# Altium schematic sheet DAP_Scheme.SchDoc
size 420 x 297 mm; Author: ALTIUM GOSTBOM2.0 KEV; SheetNumber: 2; SheetTotal: 3
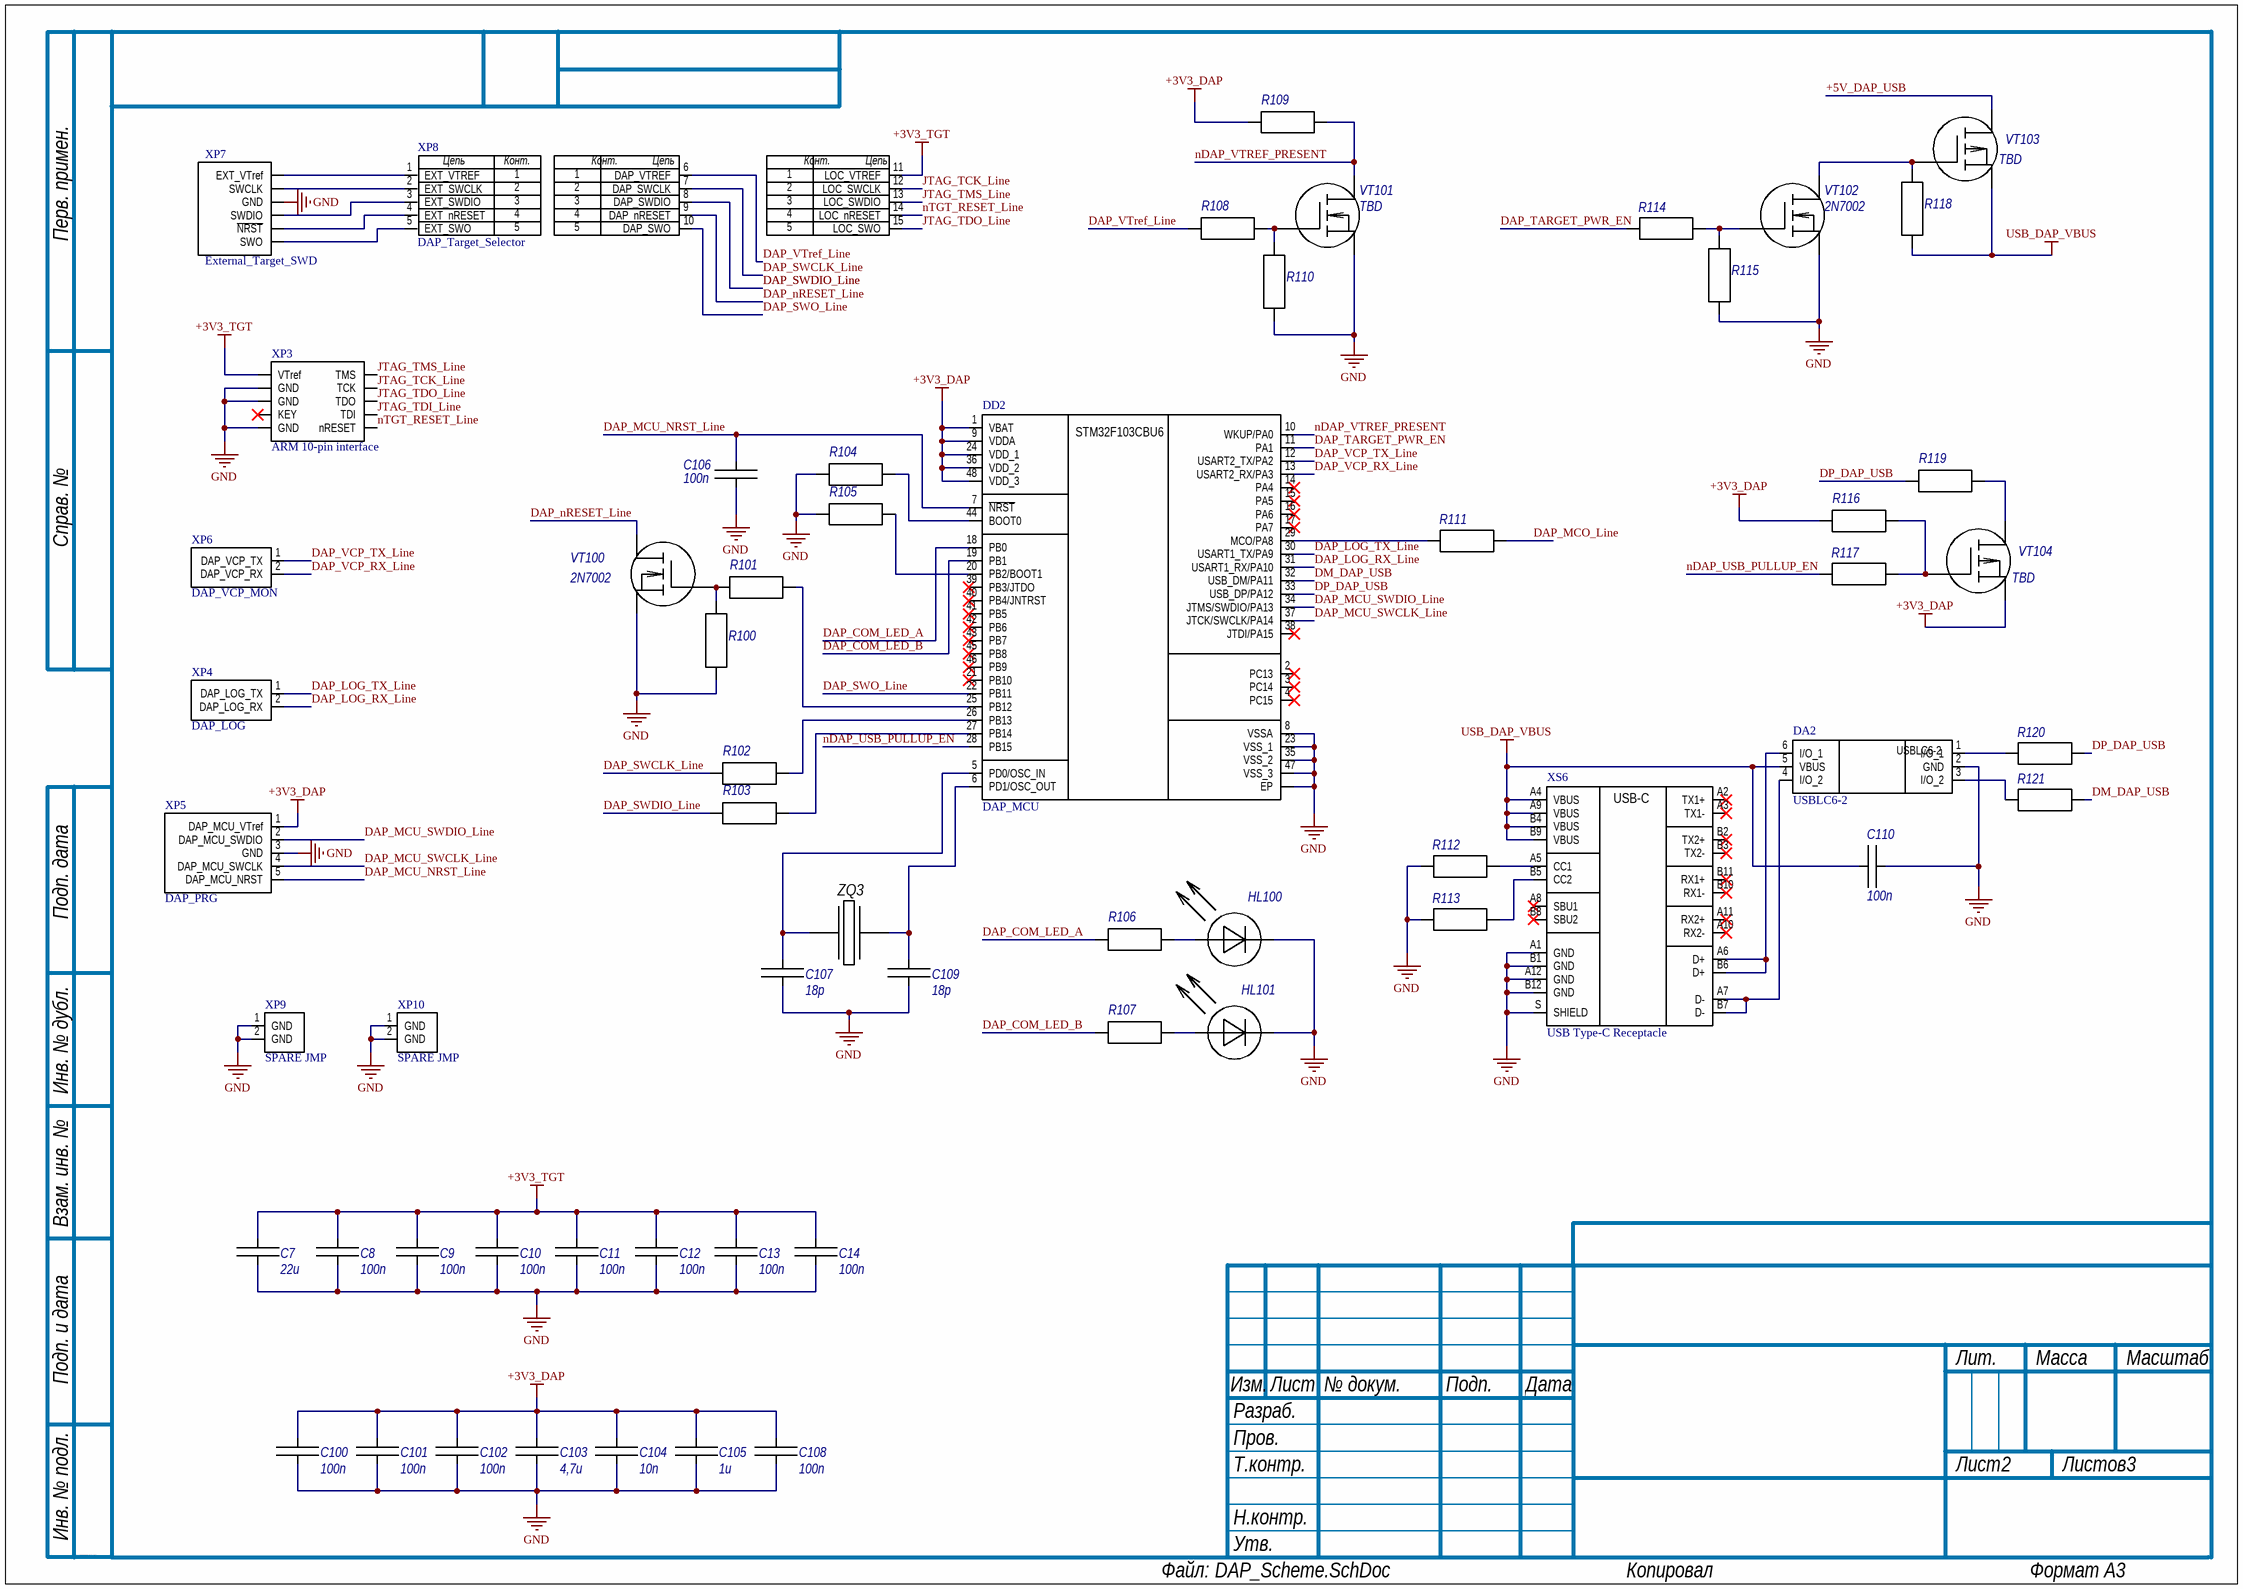
[diagram p0: DAP_Scheme.SchDoc]

## Parts
C7  22u
C8  100n
C9  100n
C10  100n
C11  100n
C12  100n
C13  100n
C14  100n
C100  100n
C101  100n
C102  100n
C103  4,7u
C104  10n
C105  1u
C106  100n
C107  18p
C108  100n
C109  18p
C110  100n
DA2  USBLC6-2
DD2  DAP_MCU
HL100  TBD  (value not drawn)
HL101  TBD  (value not drawn)
R100  10k  (value not drawn)
R101  1k  (value not drawn)
R102  TBD  (value not drawn)
R103  TBD  (value not drawn)
R104  10k  (value not drawn)
R105  10k  (value not drawn)
R106  5,1k  (value not drawn)
R107  5,1k  (value not drawn)
R108  1k  (value not drawn)
R109  10k  (value not drawn)
R110  10k  (value not drawn)
R111  22  (value not drawn)
R112  5,1k  (value not drawn)
R113  5,1k  (value not drawn)
R114  1k  (value not drawn)
R115  10k  (value not drawn)
R116  10k  (value not drawn)
R117  1k  (value not drawn)
R118  10k  (value not drawn)
R119  1,5k  (value not drawn)
R120  22  (value not drawn)
R121  22  (value not drawn)
VT100  2N7002
VT101  TBD
VT102  2N7002
VT103  TBD
VT104  TBD
XP3  ARM 10-pin interface  [ARM 10-pin interface]
XP4  DAP_LOG  [DAP_LOG]
XP5  DAP_PRG  [DAP_PRG]
XP6  DAP_VCP_MON  [DAP_VCP_MON]
XP7  External_Target_SWD  [External_Target_SWD]
XP8  DAP_Target_Selector
XP9  SPARE JMP  [SPARE JMP]
XP10  SPARE JMP  [SPARE JMP]
XS6  USB Type-C Receptacle  [TE USB-C 2129691-1]
ZQ3  Кварцевые резонаторы  [DSO-N4]  (value not drawn)

## Nets
+3V3_DAP: C100.1 C101.1 C102.1 C103.1 C104.1 C105.1 C108.1 DD2.1(VBAT) DD2.9(VDDA) DD2.24(VDD_1) DD2.36(VDD_2) DD2.48(VDD_3) R109.1 R116.1 VT104.S XP5.1(DAP_MCU_VTref)
+3V3_TGT: C7.1 C8.1 C9.1 C10.1 C11.1 C12.1 C13.1 C14.1 XP3.1(VTref) XP8.11(LOC_VTREF)
GND: C7.2 C8.2 C9.2 C10.2 C11.2 C12.2 C13.2 C14.2 C100.2 C101.2 C102.2 C103.2 C104.2 C105.2 C106.2 C107.2 C108.2 C109.2 C110.2 DA2.2(GND) DD2.8(VSSA) DD2.23(VSS_1) DD2.35(VSS_2) DD2.47(VSS_3) DD2.49(EP) HL100.2(C) HL101.2(C) R100.2 R104.2 R105.2 R110.2 R112.2 R113.2 R115.2 VT100.S VT101.S VT102.S XP3.3(GND) XP3.5(GND) XP3.9(GND) XP5.3(GND) XP7.3(GND) XP9.1(GND) XP9.2(GND) XP10.1(GND) XP10.2(GND) XS6.A1(GND) XS6.A12(GND) XS6.B1(GND) XS6.B12(GND) XS6.S(SHIELD)
USB_DAP_VBUS: C110.1 DA2.5(VBUS) R118.2 VT103.S XS6.A4(VBUS) XS6.A9(VBUS) XS6.B4(VBUS) XS6.B9(VBUS)
+5V_DAP_USB: VT103.D
DAP_COM_LED_A: DD2.18(PB0) R106.1
DAP_COM_LED_B: DD2.19(PB1) R107.1
DAP_LOG_RX_Line: DD2.31(USART1_RX/PA10) XP4.2(DAP_LOG_RX)
DAP_LOG_TX_Line: DD2.30(USART1_TX/PA9) XP4.1(DAP_LOG_TX)
DAP_MCO_Line: R111.1
DAP_MCU_NRST_Line: C106.1 DD2.7(~{NRST}) XP5.5(DAP_MCU_NRST)
DAP_MCU_SWCLK_Line: DD2.37(JTCK/SWCLK/PA14) XP5.4(DAP_MCU_SWCLK)
DAP_MCU_SWDIO_Line: DD2.34(JTMS/SWDIO/PA13) XP5.2(DAP_MCU_SWDIO)
DAP_nRESET_Line: VT100.D XP8.9(DAP_nRESET)
DAP_SWCLK_Line: R102.2 XP8.7(DAP_SWCLK)
DAP_SWDIO_Line: R103.2 XP8.8(DAP_SWDIO)
DAP_SWO_Line: DD2.22(PB11) XP8.10(DAP_SWO)
DAP_TARGET_PWR_EN: DD2.11(PA1) R114.2
DAP_VCP_RX_Line: DD2.13(USART2_RX/PA3) XP6.2(DAP_VCP_RX)
DAP_VCP_TX_Line: DD2.12(USART2_TX/PA2) XP6.1(DAP_VCP_TX)
DAP_VTref_Line: R108.1 XP8.6(DAP_VTREF)
DM_DAP_USB: DD2.32(USB_DM/PA11) R121.1
DP_DAP_USB: DD2.33(USB_DP/PA12) R119.1 R120.1
JTAG_TCK_Line: XP3.4(TCK) XP8.12(LOC_SWCLK)
JTAG_TDI_Line: XP3.8(TDI)
JTAG_TDO_Line: XP3.6(TDO) XP8.15(LOC_SWO)
JTAG_TMS_Line: XP3.2(TMS) XP8.13(LOC_SWDIO)
nDAP_USB_PULLUP_EN: DD2.28(PB15) R117.2
nDAP_VTREF_PRESENT: DD2.10(WKUP/PA0) R109.2 VT101.D
nTGT_RESET_Line: XP3.10(nRESET) XP8.14(LOC_nRESET)
NetC107_1: C107.1 DD2.5(PD0/OSC_IN) ZQ3.1
NetC109_1: C109.1 DD2.6(PD1/OSC_OUT) ZQ3.3
NetDA2_1: DA2.1(I/O_1) R120.2
NetDA2_3: DA2.3(I/O_2) R121.2
NetDA2_4: DA2.4(I/O_2) XS6.A7(D-) XS6.B7(D-)
NetDA2_6: DA2.6(I/O_1) XS6.A6(D+) XS6.B6(D+)
NetDD2_20: DD2.20(PB2/BOOT1) R105.1
NetDD2_25: DD2.25(PB12) R101.1
NetDD2_26: DD2.26(PB13) R102.1
NetDD2_27: DD2.27(PB14) R103.1
NetDD2_29: DD2.29(MCO/PA8) R111.2
NetDD2_44: DD2.44(BOOT0) R104.1
NetHL100_1: HL100.1(A) R106.2
NetHL101_1: HL101.1(A) R107.2
NetR100_1: R100.1 R101.2 VT100.G
NetR108_2: R108.2 R110.1 VT101.G
NetR112_1: R112.1 XS6.A5(CC1)
NetR113_1: R113.1 XS6.B5(CC2)
NetR114_1: R114.1 R115.1 VT102.G
NetR116_2: R116.2 R117.1 VT104.G
NetR118_1: R118.1 VT102.D VT103.G
NetR119_2: R119.2 VT104.D
NetXP7_1: XP7.1(EXT_VTref) XP8.1(EXT_VTREF)
NetXP7_2: XP7.2(SWCLK) XP8.2(EXT_SWCLK)
NetXP7_4: XP7.4(SWDIO) XP8.3(EXT_SWDIO)
NetXP7_5: XP7.5(~{NRST}) XP8.4(EXT_nRESET)
NetXP7_6: XP7.6(SWO) XP8.5(EXT_SWO)

Not connected (* = marked no-connect by the designer): DD2 2(PC13)* 3(PC14)* 4(PC15)* 14(PA4)* 15(PA5)* 16(PA6)* 17(PA7)* 21(PB10)* 38(JTDI/PA15)* 39(PB3/JTDO)* 40(PB4/JNTRST)* 41(PB5)* 42(PB6)* 43(PB7)* 45(PB8)* 46(PB9)*; XP3 7(KEY)*; XS6 A2(TX1+)* A3(TX1-)* A8(SBU1)* A10(RX2-)* A11(RX2+)* B2(TX2+)* B3(TX2-)* B8(SBU2)* B10(RX1-)* B11(RX1+)*

## Notes on the sheet
- Перв. примен.
- Справ. №
- Подп. дата
- Инв. № дубл.
- Взам. инв. №
- Подп. и дата
- Изм.
- Разраб.
- Лист
- № докум.
- Подп.
- Дата
- Лит.
- Масса
- Масштаб
- Пров.
- Т.контр.
- Листов
- Инв. № подл.
- Н.контр.
- Утв.
- ALTIUM GOSTBOM2.0 KEV
- Файл:
- Копировал
- Формат А3
- (in symbol Component_1) STM32F103CBU6
- (in symbol DAP_Target_Selector) Цепь; Конт.
- (in symbol USB Type-C Receptacle) USB-C

## Library data of the parts
C7 = Cap: K1986VE92FI +3V3_TGT UCC bulk decoupling capacitor, 22uF, X7R
C8 = Cap: K1986VE92FI UCC local decoupling capacitor, 100nF, X7R; assign close to UCC pin 1
C9 = Cap: K1986VE92FI UCC local decoupling capacitor, 100nF, X7R; assign close to UCC pin 12
C10 = Cap: K1986VE92FI UCC local decoupling capacitor, 100nF, X7R; assign close to UCC pin 38
C11 = Cap: K1986VE92FI UCC local decoupling capacitor, 100nF, X7R; assign close to UCC pin 48
C12 = Cap: K1986VE92FI BUcc local decoupling capacitor, 100nF, X7R; BUcc tied to +3V3_TGT
C13 = Cap: K1986VE92FI AUcc1 to AGND1 analog decoupling capacitor, 100nF, X7R
C14 = Cap: K1986VE92FI AUcc to AGND analog decoupling capacitor, 100nF, X7R
C100 = Cap: DAP MCU VDD1 local decoupling capacitor, 100nF, X7R
C101 = Cap: DAP MCU VDD2 local decoupling capacitor, 100nF, X7R
C102 = Cap: DAP MCU VDD3 local decoupling capacitor, 100nF, X7R
C103 = Cap: DAP MCU VDD3 bulk decoupling capacitor, 4.7uF, X7R
C104 = Cap: DAP MCU VDDA high-frequency analog decoupling capacitor, 10nF, X7R or C0G
C105 = Cap: DAP MCU VDDA bulk analog decoupling capacitor, 1uF, X7R
C106 = Cap: DAP STM32F103 NRST reset timing and noise-filter capacitor, 100nF, X7R
C107 = Cap: DAP STM32F103 HSE OSC_IN crystal load capacitor, 18pF provisional, C0G/NP0; recalculate for selected crystal
C108 = Cap: DAP MCU VBAT local decoupling capacitor, 100nF, X7R; VBAT tied to +3V3_DAP
C109 = Cap: DAP STM32F103 HSE OSC_OUT crystal load capacitor, 18pF provisional, C0G/NP0; match C107
C110 = Cap: DAP USB connector VBUS bypass capacitor near ESD protection, value 100n
DA2 = USBLC6-2: USBLC6-2SC6 low-capacitance ESD protection for DAP USB D+ and D-
DD2 = Component_1: STM32F103CBU6 CMSIS-DAP controller with USB, SWD, VCP and 8MHz MCO for local K1986 target
HL100 = LED: DAP COM indicator channel A LED; color and part TBD
HL101 = LED: DAP COM indicator channel B LED; color and part TBD
R100 = res: Target nRESET NMOS gate pull-down to GND, 10k; default released
R101 = res: DAP MCU to target nRESET NMOS gate series resistor, 1k
R102 = res: DAP SWCLK series damping resistor, final value TBD, candidate 22 to 47 ohm
R103 = res: DAP SWDIO series damping resistor, final value TBD, candidate 22 to 47 ohm
R104 = res: STM32F103 BOOT0 pull-down to GND for Flash boot, 10k
R105 = res: STM32F103 PB2/BOOT1 pull-down to GND, 10k
R106 = res: DAP COM indicator channel A current-limiting resistor, 5.1k
R107 = res: DAP COM indicator channel B current-limiting resistor, 5.1k
R108 = res: Selected target VTref detector NMOS gate series resistor, 1k
R109 = res: Selected target VTref detector drain pull-up to +3V3_DAP, 10k
R110 = res: Selected target VTref detector NMOS gate-to-source pull-down, 10k
R111 = res: DAP PA8/MCO series source-termination resistor for K1986 OSC_IN, 22 ohm provisional
R112 = res: DAP USB Type-C Device/UFP CC1 Rd pull-down resistor to GND, 5.1k, 1%
R113 = res: DAP USB Type-C Device/UFP CC2 Rd pull-down resistor to GND, 5.1k, 1%
R114 = res: DAP_TARGET_PWR_EN to power-switch NMOS gate series resistor, 1k
R115 = res: DAP power-switch NMOS gate pull-down to GND, 10k; default off
R116 = res: DAP USB pull-up P-MOSFET gate-to-source pull-up, 10k; default off
R117 = res: DAP USB pull-up P-MOSFET gate series resistor from PB15, 1k
R118 = res: DAP power P-MOSFET gate-to-source pull-up to USB_DAP_VBUS, 10k; default off
R119 = res: DAP USB full-speed D+ pull-up resistor to switched +3V3_DAP, 1.5k
R120 = res: DAP USB D+ series damping resistor, 22 ohm provisional
R121 = res: DAP USB D- series damping resistor, 22 ohm provisional
VT100 = TRANS-N-FET: 2N7002 open-drain NMOS driver for target nRESET, controlled by DAP MCU
VT101 = TRANS-N-FET: NMOS detector for selected target VTref; active-low nDAP_VTREF_PRESENT, part TBD
VT102 = TRANS-N-FET: 2N7002 NMOS gate driver for DAP USB VBUS high-side P-MOSFET
VT103 = TRANS-P-FET: DAP USB VBUS high-side P-MOSFET switch feeding +5V_DAP_USB and T-selector, part TBD
VT104 = TRANS-P-FET: DAP USB D+ 1.5k pull-up high-side P-MOSFET switch, exact part TBD
XP3 = ARM 10-pin interface: ARM 10-pin local target debug connector for JTAG_A signals and +3V3_TGT VTref
XP4 = DAP_LOG: DAP logic-level UART log interface connector
XP5 = DAP_PRG: Service SWD connector for programming and recovery of the STM32F103 DAP MCU
XP6 = DAP_VCP_MON: DAP VCP UART monitoring interface connector for target RX/TX signals
XP7 = External_Target_SWD: External target SWD connector; EXT_VTREF is a target-supplied logic reference, not a power output
XP8 = DAP_Target_Selector: DAP route selector between external SWD target and local K1986 debug signals
XP9 XP10 = SPARE JMP: Spare GND jumper contact next to DAP external target power outputs
XS6 = USB Type-C Receptacle: DAP USB Type-C receptacle, fixed Device/UFP/Sink; USB_DAP_VBUS input, shield tied to GND
ZQ3 = Кварцевые резонаторы: DAP STM32F103CBU6 HSE crystal, 8MHz; load capacitance and exact part TBD; Alternating Manufacture: АО "Завод "Метеор"; Product Code: 63 2100; Model: SMD07050C4; TU/GOST: фирма EPSON; Value: 32768 Hz; Component Name: MC-206 32,768 кГц; Published: 24.05.2021; Publisher: АО "НПО КАДЕТЕК"; Distributer: АО "Чип и Дип"; Category: Кварцевые резонаторы; Type: SMD07050C4